# EAGLE schematic OSSICommsBeaconNew (EAGLE 6.1)
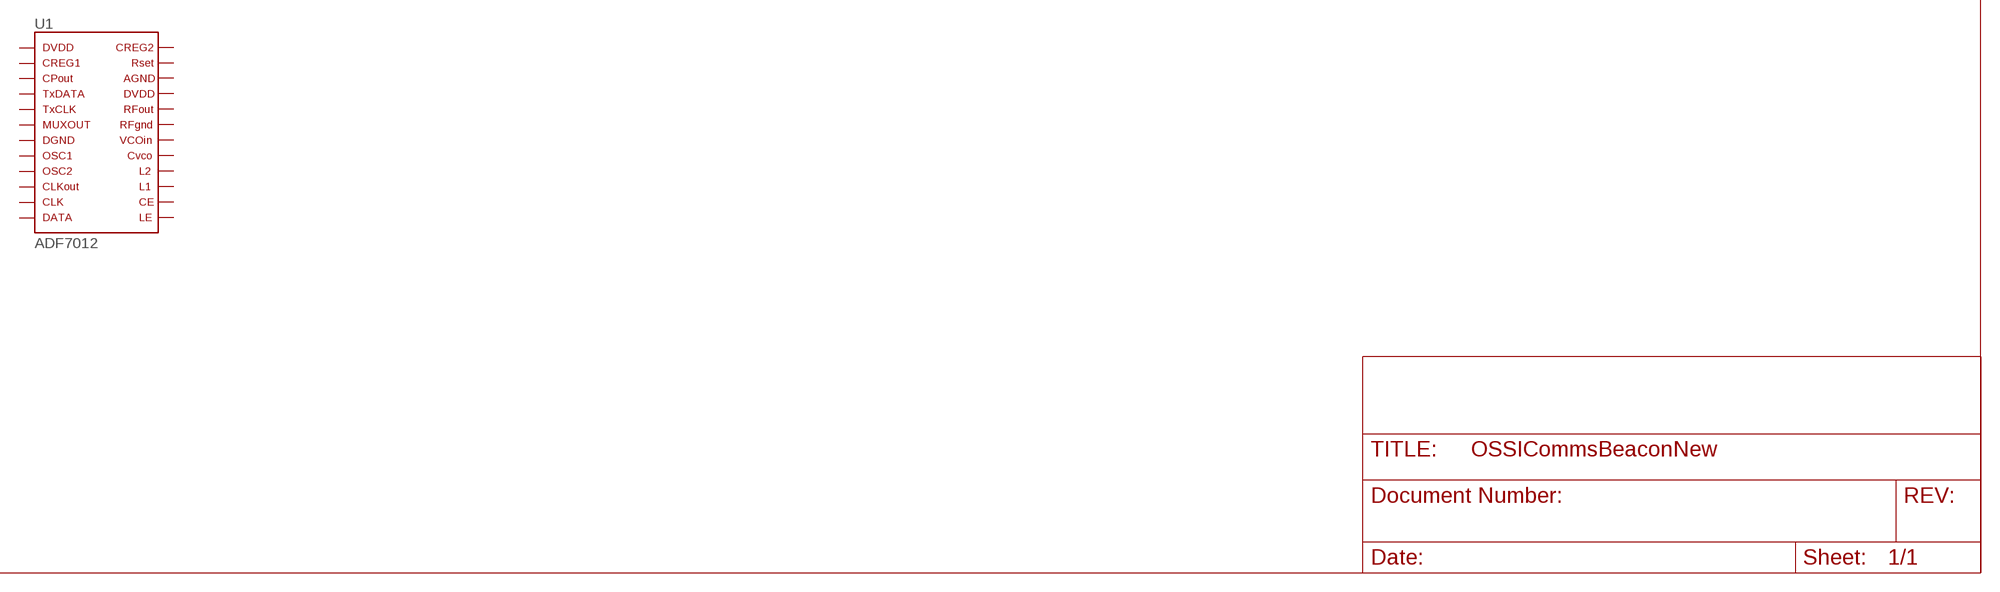
[diagram p0: schematic, sheet 1]

## Parts
U1  ADF7012  [TSSOP24]
Unconnected: U1.2(CREG1) U1.3(CPOUT) U1.4(TXDATA) U1.5(TXCLK) U1.7(DGND) U1.8(OSC1) U1.9(OSC2) U1.10(CLKOUT) U1.11(CLK) U1.12(DATA) U1.13(LE) U1.14(CE) U1.15(L1) U1.16(L2) U1.17(CVCO) U1.18(VCOIN) U1.20(RFOUT) U1.23(RSET) U1.24(CREG2)

## Power pins joined to a net without a drawn wire
AGND: U1.22(AGND)
DVDD_1: U1.1(DVDD_1)
DVDD_2: U1.21(DVDD_2)
MUXOUT: U1.6(MUXOUT)
RFGND: U1.19(RFGND)

## Library data of the parts
U1 = OSSI:ADF7012